# Altium schematic sheet HDMI_To_MIPI_PHY.SchDoc
size A4; SheetNumber: 2; SheetTotal: 3
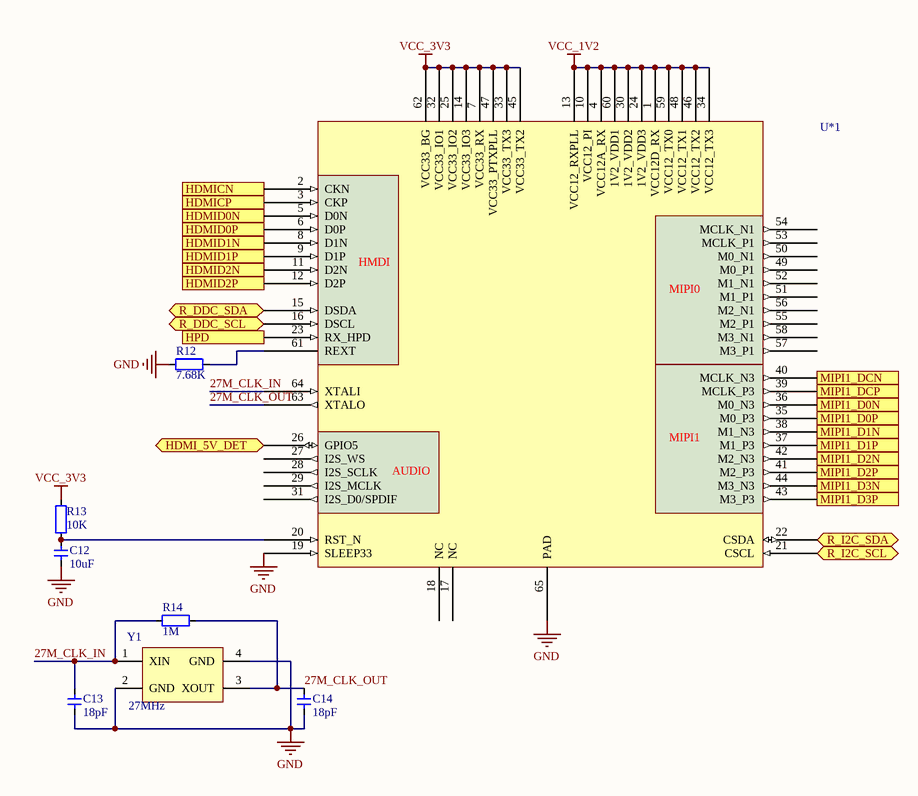
[diagram p0: HDMI_To_MIPI_PHY.SchDoc]

## Parts
C12  10uF  [CAP_0402]
C13  18pF  [CAP_0402]
C14  18pF  [CAP_0402]
R12  7.68K  [RES_0402]
R13  10K  [RES_0402]
R14  1M  [RES_0402]
U*1  LT6911C  [QFN-64-0.4mm]  (value not drawn)
Y1  27MHz  [晶振2520]

## Ports
HDMI_5V_DET (bidir), HDMICN (in), HDMICP (in), HDMID0N (in), HDMID0P (in), HDMID1N (in), HDMID1P (in), HDMID2N (in), HDMID2P (in), HPD (out), MIPI1_D0N (out), MIPI1_D0P (out), MIPI1_D1N (out), MIPI1_D1P (out), MIPI1_D2N (out), MIPI1_D2P (out), MIPI1_D3N (out), MIPI1_D3P (out), MIPI1_DCN (out), MIPI1_DCP (out), R_DDC_SCL (bidir), R_DDC_SDA (bidir), R_I2C_SCL (bidir), R_I2C_SDA (bidir)

## Nets
GND: C12.1 C13.1 C14.1 R12.1 U*1.19(SLEEP33) U*1.65(PAD) Y1.2(GND) Y1.4(GND)
VCC_1V2: U*1.1(VCC12D_RX) U*1.4(VCC12A_RX) U*1.10(VCC12_PI) U*1.13(VCC12_RXPLL) U*1.24(1V2_VDD3) U*1.30(1V2_VDD2) U*1.34(VCC12_TX3) U*1.46(VCC12_TX2) U*1.48(VCC12_TX1) U*1.59(VCC12_TX0) U*1.60(1V2_VDD1)
VCC_3V3: R13.2 U*1.7(VCC33_RX) U*1.14(VCC33_IO3) U*1.25(VCC33_IO2) U*1.32(VCC33_IO1) U*1.33(VCC33_TX3) U*1.45(VCC33_TX2) U*1.47(VCC33_PTXPLL) U*1.62(VCC33_BG)
27M_CLK_IN: C13.2 R14.1 U*1.64(XTALI) Y1.1(XIN)
27M_CLK_OUT: C14.2 R14.2 U*1.63(XTALO) Y1.3(XOUT)
HDMI_5V_DET: U*1.26(GPIO5) ; port HDMI_5V_DET
HDMICN: U*1.2(CKN) ; port HDMICN
HDMICP: U*1.3(CKP) ; port HDMICP
HDMID0N: U*1.5(D0N) ; port HDMID0N
HDMID0P: U*1.6(D0P) ; port HDMID0P
HDMID1N: U*1.8(D1N) ; port HDMID1N
HDMID1P: U*1.9(D1P) ; port HDMID1P
HDMID2N: U*1.11(D2N) ; port HDMID2N
HDMID2P: U*1.12(D2P) ; port HDMID2P
HPD: U*1.23(RX_HPD) ; port HPD
MIPI1_D0N: U*1.36(M0_N3) ; port MIPI1_D0N
MIPI1_D0P: U*1.35(M0_P3) ; port MIPI1_D0P
MIPI1_D1N: U*1.38(M1_N3) ; port MIPI1_D1N
MIPI1_D1P: U*1.37(M1_P3) ; port MIPI1_D1P
MIPI1_D2N: U*1.42(M2_N3) ; port MIPI1_D2N
MIPI1_D2P: U*1.41(M2_P3) ; port MIPI1_D2P
MIPI1_D3N: U*1.44(M3_N3) ; port MIPI1_D3N
MIPI1_D3P: U*1.43(M3_P3) ; port MIPI1_D3P
MIPI1_DCN: U*1.40(MCLK_N3) ; port MIPI1_DCN
MIPI1_DCP: U*1.39(MCLK_P3) ; port MIPI1_DCP
R_DDC_SCL: U*1.16(DSCL) ; port R_DDC_SCL
R_DDC_SDA: U*1.15(DSDA) ; port R_DDC_SDA
R_I2C_SCL: U*1.21(CSCL) ; port R_I2C_SCL
R_I2C_SDA: U*1.22(CSDA) ; port R_I2C_SDA
NetC12_2: C12.2 R13.1 U*1.20(RST_N)
NetR12_2: R12.2 U*1.61(REXT)

Not connected (* = marked no-connect by the designer): U*1 17(NC) 18(NC) 27(I2S_WS) 28(I2S_SCLK) 29(I2S_MCLK) 31(I2S_D0/SPDIF) 49(M0_P1) 50(M0_N1) 51(M1_P1) 52(M1_N1) 53(MCLK_P1) 54(MCLK_N1) 55(M2_P1) 56(M2_N1) 57(M3_P1) 58(M3_N1)

## Notes on the sheet
- (in symbol LT6911C) HMDI; MIPI0; MIPI1; AUDIO

## Library data of the parts
C12-C14 = 电容-0402: Capacitor; Value: 0.1u
R12-R14 = 电阻-0402: Resistor; Value: 22R
U*1 = LT6911C: HDMI to MIPI PHY
Y1 = 晶振-4Pin-无源: 2520无源; MF: ECS International; MP: ECS-3225S30-240-EN-TR; Package: SMD-6 ECS International; Price: 0.75 USD; Availability: Unavailable; Value: *